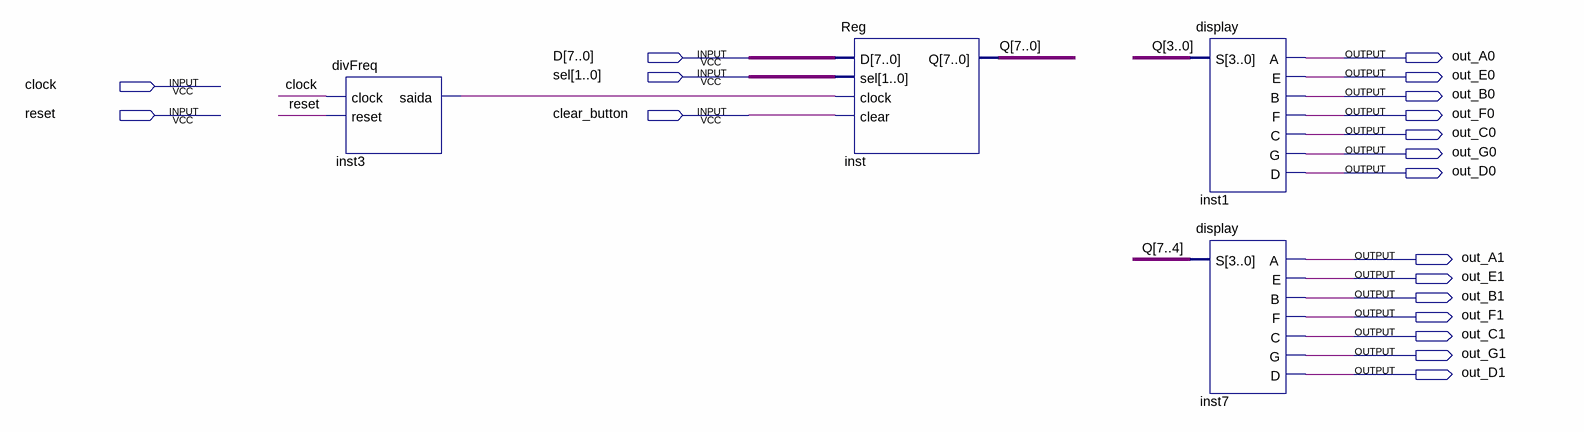
[diagram p0: schematic sheet]
// Quartus schematic CONTADOR_UP_DOWN.bdf as structural Verilog: 4 symbols, 19 pins
module CONTADOR_UP_DOWN (
  input  [7:0] D,
  input  [1:0] sel,
  input  clock,
  input  reset,
  input  clear_button,
  output out_A0,
  output out_E0,
  output out_B0,
  output out_F0,
  output out_C0,
  output out_G0,
  output out_D0,
  output out_A1,
  output out_E1,
  output out_B1,
  output out_F1,
  output out_C1,
  output out_G1,
  output out_D1
);

  wire inst3_saida;
  wire [7:0] Q;

  divFreq inst3 (.clock(clock), .reset(reset), .saida(inst3_saida));
  Reg inst (.D(D), .sel(sel), .clock(inst3_saida), .clear(clear_button), .Q(Q));
  display inst1 (.S(Q[3:0]), .A(out_A0), .E(out_E0), .B(out_B0), .F(out_F0), .C(out_C0), .G(out_G0), .D(out_D0));
  display inst7 (.S(Q[7:4]), .A(out_A1), .E(out_E1), .B(out_B1), .F(out_F1), .C(out_C1), .G(out_G1), .D(out_D1));
endmodule
